# EAGLE schematic datalogger-hat-brd (EAGLE 9.2.2)
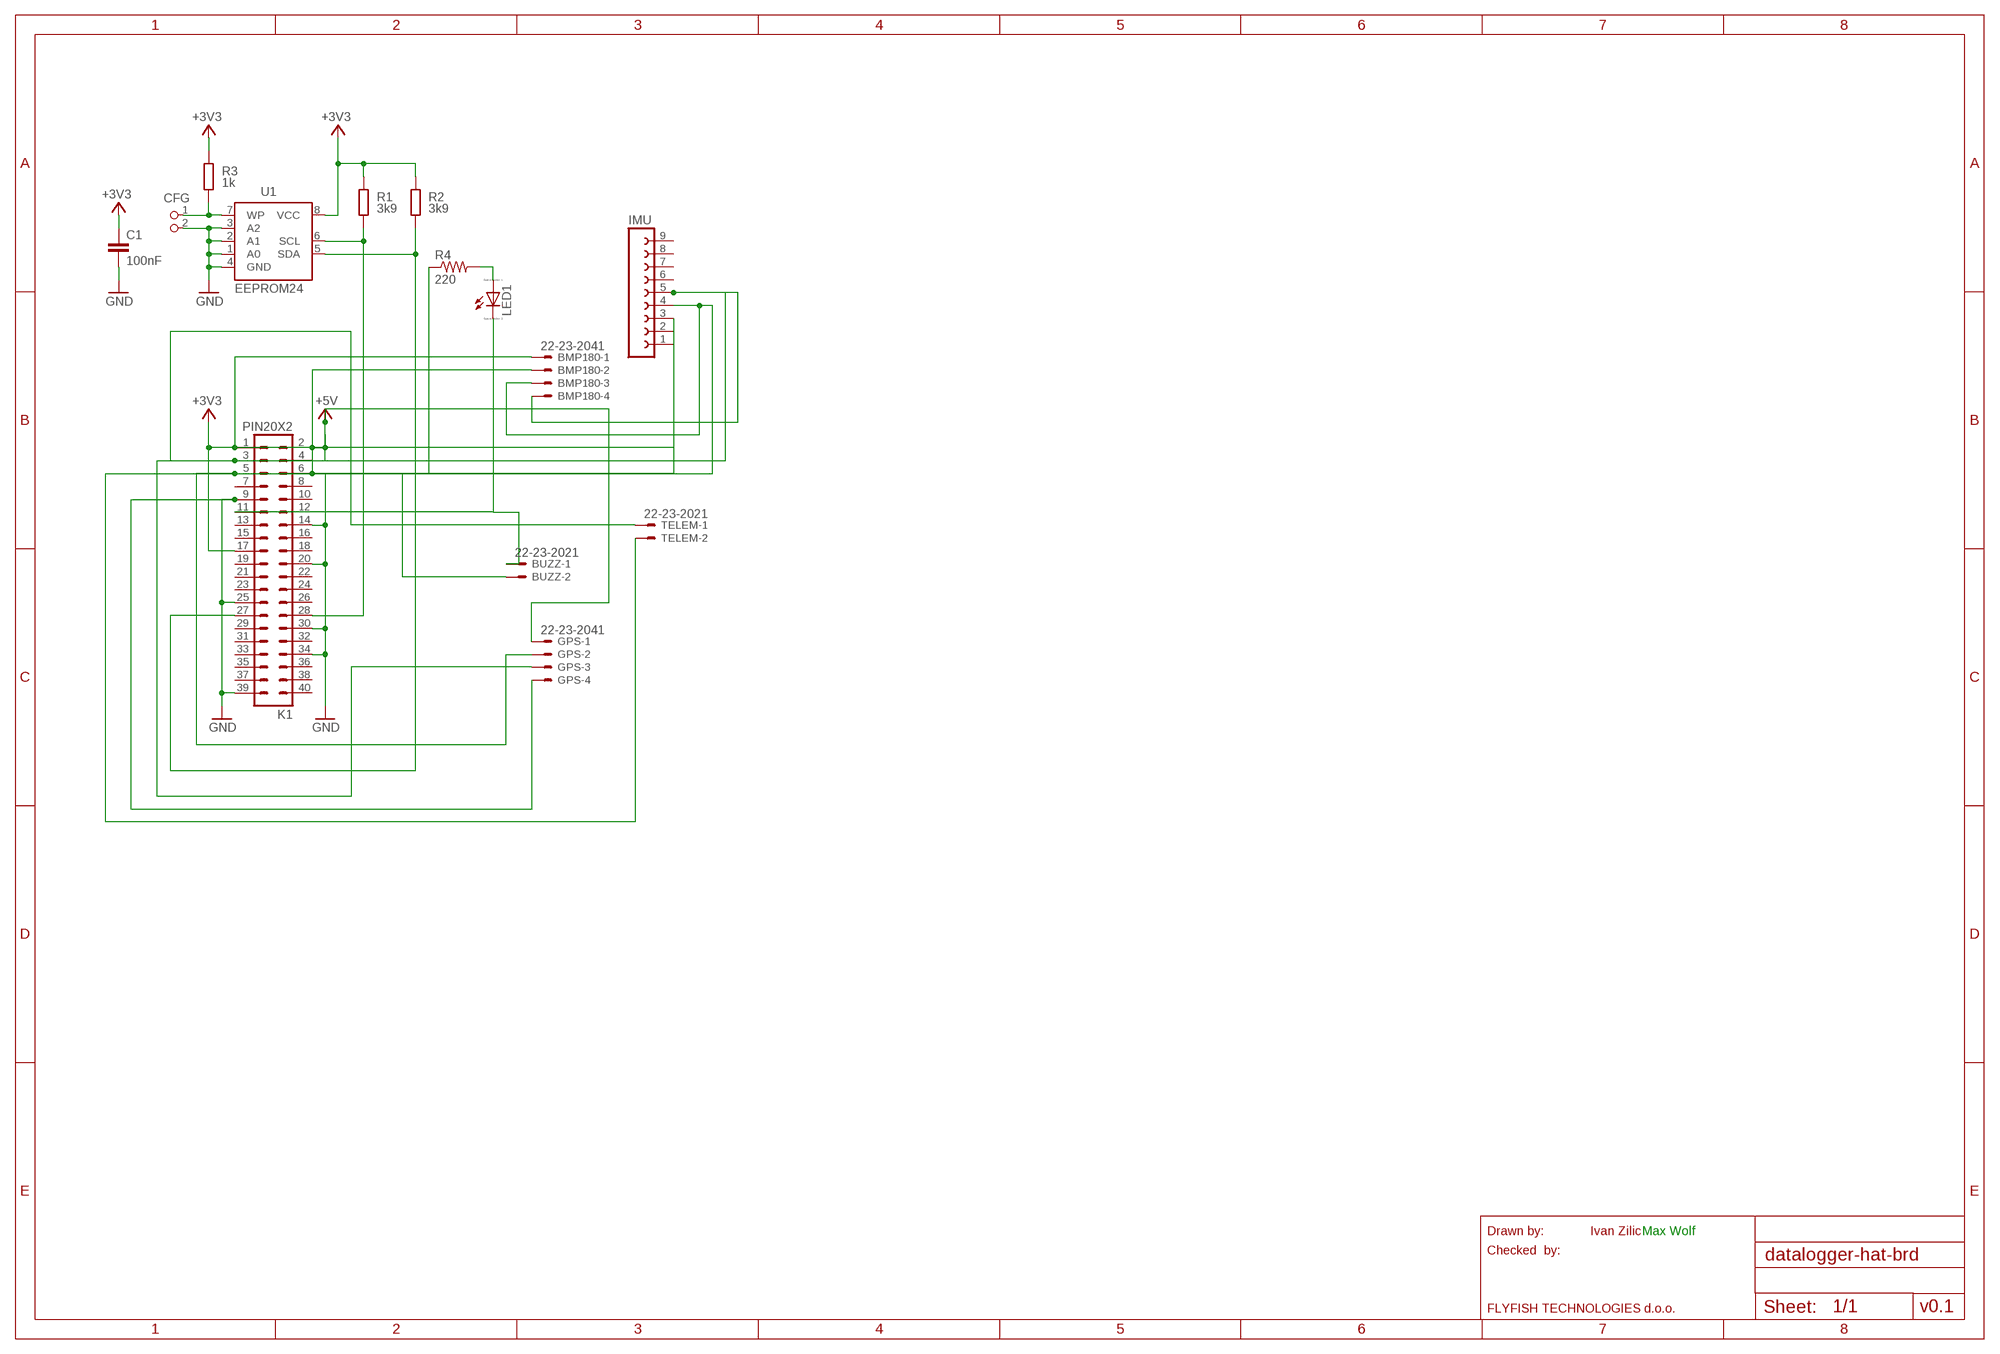
[diagram p0: schematic, sheet 1]

## Parts
BMP180  22-23-2041  [22-23-2041]
BUZZ  22-23-2021  [22-23-2021]
C1  100nF  C-EUC0805K  [C0805K]
CFG  PIN2_100  [PIN_W_2]
GPS  22-23-2041  [22-23-2041]
IMU  FE09-1  [FE09]
K1  PIN20X2  [PIN_20X2]
LED1  LED_ELD260  [LED_LD260]
R1  3k9  R-EU_M0805  [M0805]
R2  3k9  R-EU_M0805  [M0805]
R3  1k  R-EU_M0805  [M0805]
R4  220  R-US_0204/5  [0204/5]
TELEM  22-23-2021  [22-23-2021]
U1  EEPROM24  [SOIC8]

## Nets
+3V3: BMP180.1 C1.1 IMU.1 K1.1 K1.17 R1.2 R2.2 R3.2 U1.8(VCC)
+5V: GPS.1 K1.2 K1.4
GND: BMP180.2 BUZZ.2 C1.2 CFG.2 GPS.4 IMU.3 K1.6 K1.9 K1.14 K1.20 K1.25 K1.30 K1.34 K1.39 R4.1 U1.1(A0) U1.2(A1) U1.3(A2) U1.4(GND)
N$1: K1.28 R1.1 U1.6(SCL)
N$2: K1.27 R2.1 U1.5(SDA)
N$3: CFG.1 R3.1 U1.7(WP)
N$4: BMP180.4 GPS.3 IMU.5 K1.3 TELEM.1
N$5: BMP180.3 GPS.2 IMU.4 K1.5 TELEM.2
N$6: BUZZ.1 K1.11 LED1.K(C)
N$7: LED1.A R4.2
Unconnected: IMU.2 IMU.6 IMU.7 IMU.8 IMU.9 K1.7 K1.8 K1.10 K1.12 K1.13 K1.15 K1.16 K1.18 K1.19 K1.21 K1.22 K1.23 K1.24 K1.26 K1.29 K1.31 K1.32 K1.33 K1.35 K1.36 K1.37 K1.38 K1.40

## Notes on the sheet
- Drawn by: | Ivan Zilic | Max Wolf
- Checked  by:
- FLYFISH TECHNOLOGIES d.o.o. | v0.1

## Library data of the parts
BMP180 GPS = con-molex:22-23-2041: .100" (2.54mm) Center Header - 4 Pin; MF: MOLEX; MPN: 22-23-2041; OC_FARNELL: 1462920; OC_NEWARK: 38C0355
BUZZ TELEM = con-molex:22-23-2021: .100" (2.54mm) Center Header - 2 Pin; MF: MOLEX; MPN: 22-23-2021; OC_FARNELL: 1462926; OC_NEWARK: 25C3832
C1 = resistor:C-EU: CAPACITOR, European symbol; DIELECTRIC: X7R
CFG = FLYFISH:PIN2
IMU = con-lsta:FE09-1: FEMALE HEADER; OC_FARNELL: unknown; OC_NEWARK: unknown
K1 = FLYFISH:PIN20X2
LED1 = eagle-ltspice:LED_E: LED Source: http://www.osram.convergy.de Source: www.luxeon.com Source: www.kingbright.com; SPICEMODEL: NONE; SPICEPREFIX: D; SPICETYPE: diode
R1-R3 = resistor:R-EU_: RESISTOR, European symbol; TOLERANCE: 5%
R4 = rcl:R-US_: RESISTOR, American symbol; SPICEPREFIX: R
U1 = FLYFISH:EEPROM24